# Altium schematic sheet 04_KEY.SchDoc
size A4
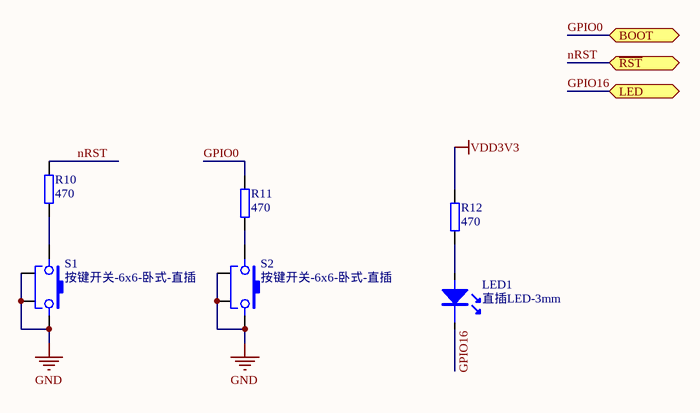
[diagram p0: 04_KEY.SchDoc]

## Parts
LED1  直插LED-3mm  [直插LED-3mm]
R10  470  [SMT_R_0402]
R11  470  [SMT_R_0402]
R12  470  [SMT_R_0402]
S1  按键开关-6x6-卧式-直插  [按键开关-6x6-卧式-直插]
S2  按键开关-6x6-卧式-直插  [按键开关-6x6-卧式-直插]

## Ports
BOOT, LED, ~{RST}

## Nets
GND: S1.2(PIN2) S1.3 S1.4 S2.2(PIN2) S2.3 S2.4
VDD3V3: R12.1
GPIO0: R11.2 ; port BOOT
GPIO16: LED1.2(K) ; port LED
nRST: R10.2 ; port ~{RST}
NetLED1_1: LED1.1(A) R12.2
NetR10_1: R10.1 S1.1(PIN1)
NetR11_1: R11.1 S2.1(PIN1)

## Library data of the parts
R10-R12 = SMT_R_0402: Surface mount resistor 0402